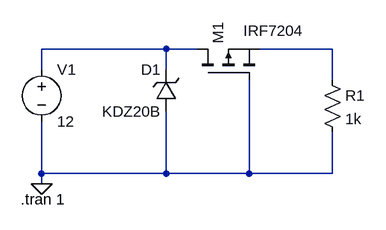
[diagram p0: schematic protection.asc]
protection.asc, the LTspice schematic file:
Version 4
SHEET 1 880 680
WIRE 192 80 0 80
WIRE 240 80 192 80
WIRE 448 80 336 80
WIRE 0 112 0 80
WIRE 192 112 192 80
WIRE 448 128 448 80
WIRE 0 272 0 192
WIRE 192 272 192 176
WIRE 192 272 0 272
WIRE 320 272 320 128
WIRE 320 272 192 272
WIRE 448 272 448 208
WIRE 448 272 320 272
WIRE 0 288 0 272
FLAG 0 288 0
SYMBOL voltage 0 96 R0
WINDOW 123 0 0 Left 0
WINDOW 39 0 0 Left 0
SYMATTR InstName V1
SYMATTR Value 12
SYMBOL zener 208 176 R180
WINDOW 0 24 64 Left 2
WINDOW 3 24 0 Left 2
SYMATTR InstName D1
SYMATTR Value KDZ20B
SYMATTR Type tvsdiode
SYMBOL pmos 240 128 R270
WINDOW 3 76 71 VRight 2
SYMATTR InstName M1
SYMATTR Value IRF7204
SYMBOL res 432 112 R0
SYMATTR InstName R1
SYMATTR Value 1k
TEXT -32 312 Left 2 !.tran 1

The netlist it stands for:
* protection.asc
V1 N001 0 12
D1 0 N001 KDZ20B
M1 N001 0 N002 N002 IRF7204
R1 N002 0 1k
.model D D
.lib standard.dio
.model NMOS NMOS
.model PMOS PMOS
.lib standard.mos
.tran 1
.backanno
.end